# EAGLE design msp430-nrf24 (EAGLE 7.2.0)
CNAME: MSP430G2553 With nRF24L01 Header; CREVISION: 0.2; DESIGNER: RNDC
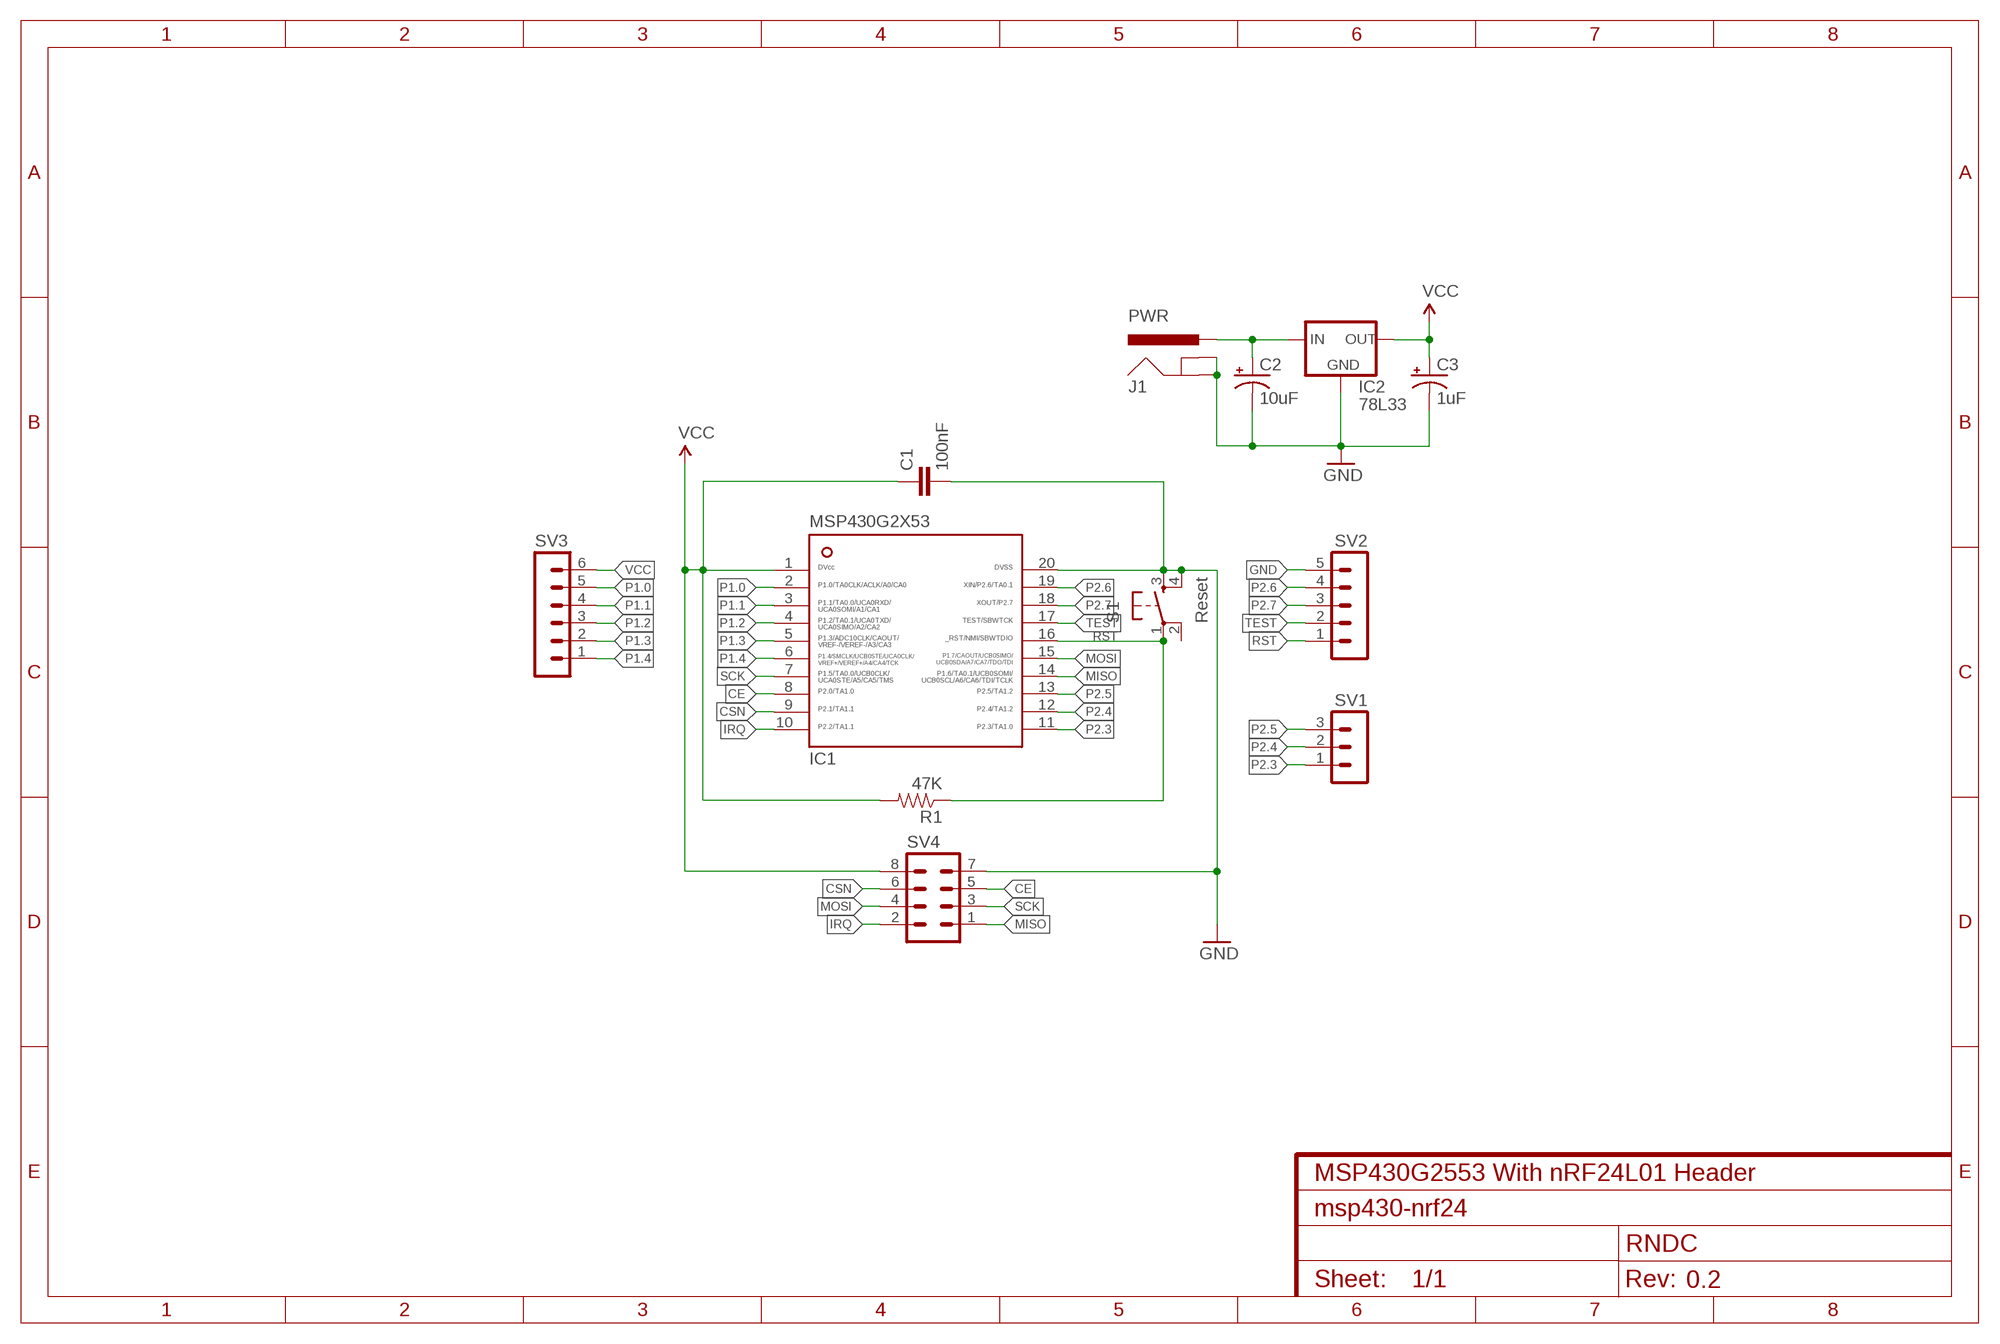
[diagram p0: schematic, sheet 1]

## Parts
C1  100nF  CAPKIT  [CAP-PTH-SMALL-KIT]
C2  10uF  CAP_POLPTH2  [CPOL-RADIAL-10UF-25V]
C3  1uF  CAP_POLPTH2  [CPOL-RADIAL-10UF-25V]
IC1  MSP430G2X53-20N20  [N20]
IC2  78L33  V_REG_78XXTO-92_UNTESTED  [TO-92]
J1  PWR  POWER_JACKPTH  [POWER_JACK_PTH]
R1  47K  RESISTORKIT  [AXIAL-0.3-KIT]
S1  Reset  TAC_SWITCHPTH  [TACTILE-PTH]
SV1  MA03-1  [MA03-1]
SV2  MA05-1  [MA05-1]
SV3  MA06-1  [MA06-1]
SV4  MA04-2  [MA04-2]

## Nets
CE: IC1.8 SV4.5
CSN: IC1.9 SV4.6
GND: C1.2 C2.2(-) C3.2(-) IC1.20 IC2.1(GND) J1.GND J1.GNDBREAK S1.3 S1.4 SV2.5 SV4.7
IRQ: IC1.10 SV4.2
MISO: IC1.14 SV4.1
MOSI: IC1.15 SV4.4
N$1: C2.1(+) IC2.2(IN) J1.PWR
P1.0: IC1.2 SV3.5
P1.1: IC1.3 SV3.4
P1.2: IC1.4 SV3.3
P1.3: IC1.5 SV3.2
P1.4: IC1.6 SV3.1
P2.3: IC1.11 SV1.1
P2.4: IC1.12 SV1.2
P2.5: IC1.13 SV1.3
P2.6: IC1.19 SV2.4
P2.7: IC1.18 SV2.3
RST: IC1.16 R1.P$1 S1.1 SV2.1
SCK: IC1.7 SV4.3
TEST: IC1.17 SV2.2
VCC: C1.1 C3.1(+) IC1.1 IC2.3(OUT) R1.P$2 SV3.6 SV4.8
Unconnected: S1.2

## Library data of the parts
C1 = SparkFun-Capacitors:CAP: Capacitor Standard 0603 ceramic capacitor, and 0.1" leaded capacitor.
C2 C3 = SparkFun-Passives:CAP_POL: Capacitor Polarized These are standard SMD and PTH capacitors. Normally 10uF, 47uF, and 100uF in electrolytic and tantalum varieties. Always verify the external diameter of the through hole cap, it varies with capacity, voltage, and manufacturer. The EIA devices should be standard.
IC1 = ti_msp430:MSP430G2X53-20
IC2 = SparkFun-PowerIC:V_REG_78XX: Voltage Regulator Standard 7805 5V regulator. IGO (Input Ground Output). Spark Fun Electronics SKU : COM-00107
J1 = SparkFun-Connectors:POWER_JACK: Power Jack This is the standard 5.5mm barrel jack for power. The PTH is the most common, proven, reliable, footprint. The Slot footprint only works if the mill layer is transmitted to the PCB fab house so be warned. Mating wall wart : TOL-00298 (and others); PROD_ID: PRT-00119
R1 = SparkFun-Passives:RESISTOR: Resistor Basic schematic elements and footprints for 0603, 1206, and PTH resistors.
S1 = SparkFun-Electromechanical:TAC_SWITCH: Momentary Switch Button commonly used for reset or general input. Spark Fun Electronics SKU : COM-00097 SMT- SWCH-08247
SV1 = con-lstb:MA03-1: PIN HEADER; OC_FARNELL: unknown; OC_NEWARK: unknown
SV2 = con-lstb:MA05-1: PIN HEADER; OC_FARNELL: unknown; OC_NEWARK: unknown
SV3 = con-lstb:MA06-1: PIN HEADER; OC_FARNELL: unknown; OC_NEWARK: unknown
SV4 = con-lstb:MA04-2: PIN HEADER; OC_FARNELL: unknown; OC_NEWARK: unknown

## Board
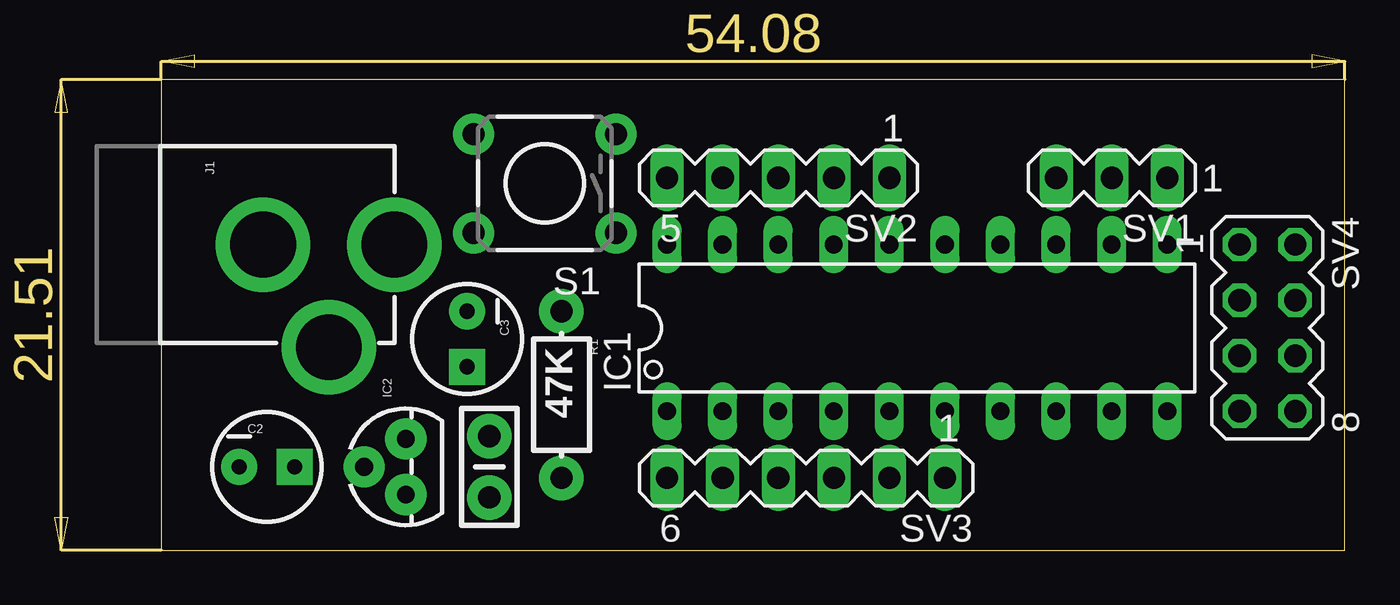
[diagram p1: board, top side]
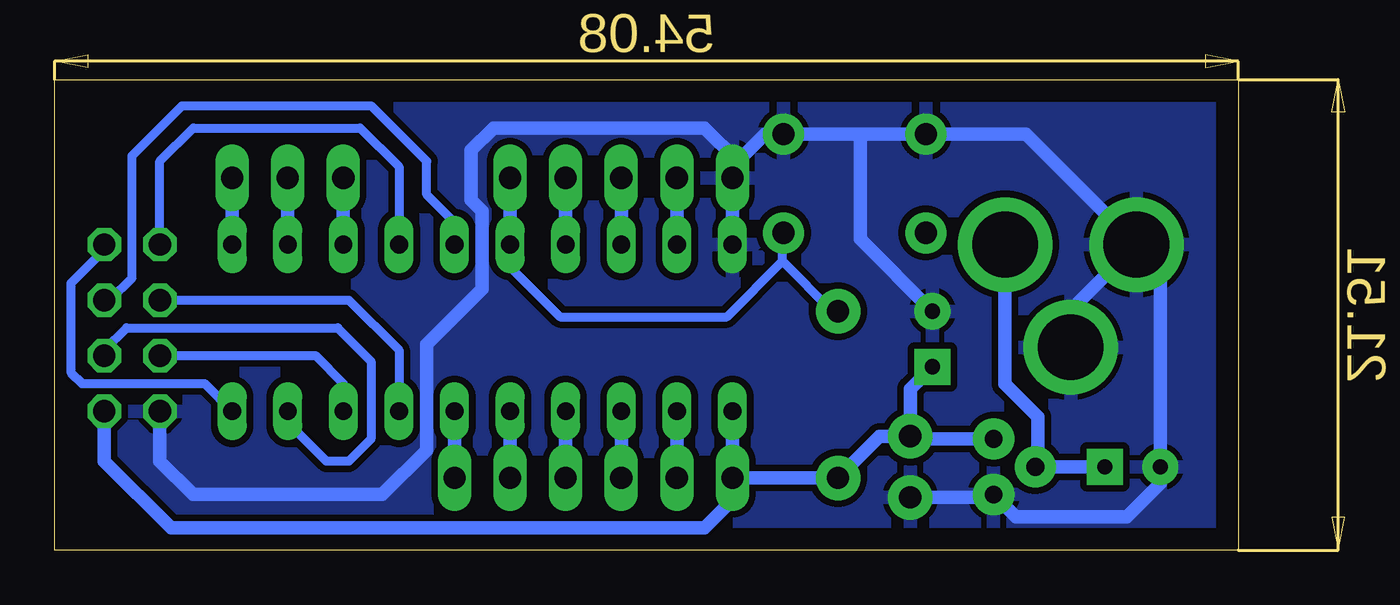
[diagram p2: board, bottom side, seen from below]

Size 54.08 x 21.51 mm. Coordinates in mm from the lower left corner, seen from the top.
Outline: 0,0 54.08,0 54.08,21.51 0,21.51 0,0
Copper layers (1*16): Top 0.035mm / dielectric 1.5mm / Bottom 0.035mm
Design rules "default *": minimum track width 10mil, minimum drill 24mil, track to track 12mil, track to pad 12mil, pad to pad 12mil, via to via 8mil, smd to smd 8mil, copper to edge 40mil, drill to drill 8mil, minimum pad ring 10mil, minimum via ring 8mil, stop-mask expansion 4mil, vias tented up to drill 0mil, thermal gap 10mil

### Footprints (pad centres in the part's own frame; a part is rotated, then mirrored left to right if it is on the bottom)
CAP-PTH-SMALL-KIT = drill 1.016 pad 2.032: 1 -1.397,0; 2 1.397,0
CPOL-RADIAL-10UF-25V = drill 0.7 pad 1.651 square: 1 1.27,0 | drill 0.7 pad 1.651: 2 -1.27,0
N20 = drill 0.813 long: 1 -11.435,-3.81; 2 -8.895,-3.81; 3 -6.355,-3.81; 4 -3.815,-3.81; 5 -1.275,-3.81; 6 1.265,-3.81; 7 3.805,-3.81; 8 6.345,-3.81; 9 8.885,-3.81; 10 11.425,-3.81; 11 11.425,3.81; 12 8.885,3.81; 13 6.345,3.81; 14 3.805,3.81; 15 1.265,3.81; 16 -1.275,3.81; 17 -3.815,3.81; 18 -6.355,3.81; 19 -8.895,3.81; 20 -11.435,3.81
TO-92 = drill 0.813 pad 1.88: 1 -1.27,0; 2 0,1.905; 3 1.27,0
POWER_JACK_PTH = drill 2.997 pad 4.318: GND 0,7.7; GNDBREAK 4.7,10.7; PWR 0,13.7
AXIAL-0.3-KIT = drill 1.016 pad 2.032: P$1 -3.81,0; P$2 3.81,0
TACTILE-PTH = drill 1.016 pad 1.88: 1 -3.251,2.261; 2 3.251,2.261; 3 -3.251,-2.261; 4 3.251,-2.261
MA03-1 = drill 1.016 long: 1 -2.54,0; 2 0,0; 3 2.54,0
MA05-1 = drill 1.016 long: 1 -5.08,0; 2 -2.54,0; 3 0,0; 4 2.54,0; 5 5.08,0
MA06-1 = drill 1.016 long: 1 -6.35,0; 2 -3.81,0; 3 -1.27,0; 4 1.27,0; 5 3.81,0; 6 6.35,0
MA04-2 = drill 1.016 octagon: 1 -3.81,-1.27; 2 -3.81,1.27; 3 -1.27,-1.27; 4 -1.27,1.27; 5 1.27,-1.27; 6 1.27,1.27; 7 3.81,-1.27; 8 3.81,1.27

### Placement (x,y rotation side)
C1  14.99,3.81 270 top
C2  4.83,3.81 0 top
C3  13.97,9.65 270 top
IC1  34.54,10.16 0 top
IC2  11.18,3.81 90 top
J1  -3.05,13.97 270 top
R1  18.29,7.11 270 top
S1  17.53,16.76 180 top
SV1  43.43,17.02 180 top
SV2  28.19,17.02 180 top
SV3  29.46,3.3 180 top
SV4  50.55,10.16 270 top

### Tracks (layer width: path | path; a pad name or v marks a point on that pad's centre or on a via)
CE
  Bottom 0.406: SV4.5 42.16,8.89 40.89,7.62 IC1.8
CSN
  Bottom 0.406: SV4.6 51.82,9.14 50.8,10.16 41.15,10.16 39.62,8.64 39.62,5.08 40.64,4.06 41.66,4.06 43.18,5.59 43.18,6.1 IC1.9
GND
  Bottom 0.61: J1.GND 3.56,12.87 C2.2 3.56,3.05 5.08,1.52 10.16,1.52 IC2.1 11.3,2.41 C1.2 | J1.GNDBREAK 7.65,10.97 J1.GND | J1.GND 9.71,19.02 S1.4 17.27,19.02 | 17.27,19.02 S1.3 21.61,19.02 22.86,17.78 | C3.2 17.27,14.22 17.27,19.02 | IC1.20 SV2.5 22.86,17.27 22.86,17.78 | SV4.7 49.28,4.06 47.75,2.54 39.12,2.54 37.08,4.57 37.08,9.4 34.54,11.94 34.54,15.49 35.05,16 35.05,18.29 34.04,19.3 24.38,19.3 22.86,17.78
  pour Bottom: 1.02,21.34 54.1,21.34 54.1,0 1.02,0
IRQ
  Bottom 0.406: SV4.2 51.82,13.72 53.34,12.19 53.34,8.13 52.83,7.62 47.24,7.62 IC1.10
MISO
  Bottom 0.406: SV4.1 49.28,17.78 47.75,19.3 40.13,19.3 38.35,17.53 IC1.14
MOSI
  Bottom 0.406: IC1.15 35.81,14.98 37.08,16.26 37.08,17.78 39.62,20.32 48.26,20.32 50.55,18.03 50.55,12.45 51.56,11.43 SV4.4
N$1
  Bottom 0.61: C2.1 IC2.2 9.14,3.94 9.14,6.1 10.65,7.6 J1.PWR
P1.0
  Bottom 0.61: IC1.2 SV3.5
P1.1
  Bottom 0.61: IC1.3 SV3.4
P1.2
  Bottom 0.61: IC1.4 SV3.3
P1.3
  Bottom 0.61: IC1.5 SV3.2
P1.4
  Bottom 0.61: IC1.6 SV3.1
P2.3
  Bottom 0.61: IC1.11 SV1.1
P2.4
  Bottom 0.61: IC1.12 SV1.2
P2.5
  Bottom 0.61: SV1.3 IC1.13
P2.6
  Bottom 0.61: IC1.19 SV2.4
P2.7
  Bottom 0.61: IC1.18 SV2.3
RST
  Bottom 0.406: IC1.16 33.27,12.95 30.99,10.67 23.37,10.67 20.83,13.21 | 20.83,13.21 20.83,14.45 S1.1 | R1.P$1 18.54,10.92 20.83,13.21
  Bottom 0.61: IC1.16 SV2.1
SCK
  Bottom 0.406: SV4.3 40.64,11.43 38.35,9.14 IC1.7
TEST
  Bottom 0.61: IC1.17 SV2.2
VCC
  Bottom 0.61: IC2.3 14.86,5.08 C1.1 | C1.1 14.99,7.37 C3.1 | C1.1 16.38,5.21 R1.P$2 SV3.6 | IC1.1 SV3.6 | SV4.8 51.82,4.06 48.77,1.02 24.38,1.02 22.86,2.54 22.86,3.05 SV3.6